# Altium schematic sheet Midi_to_CV.SchDoc
size 381 x 241 mm
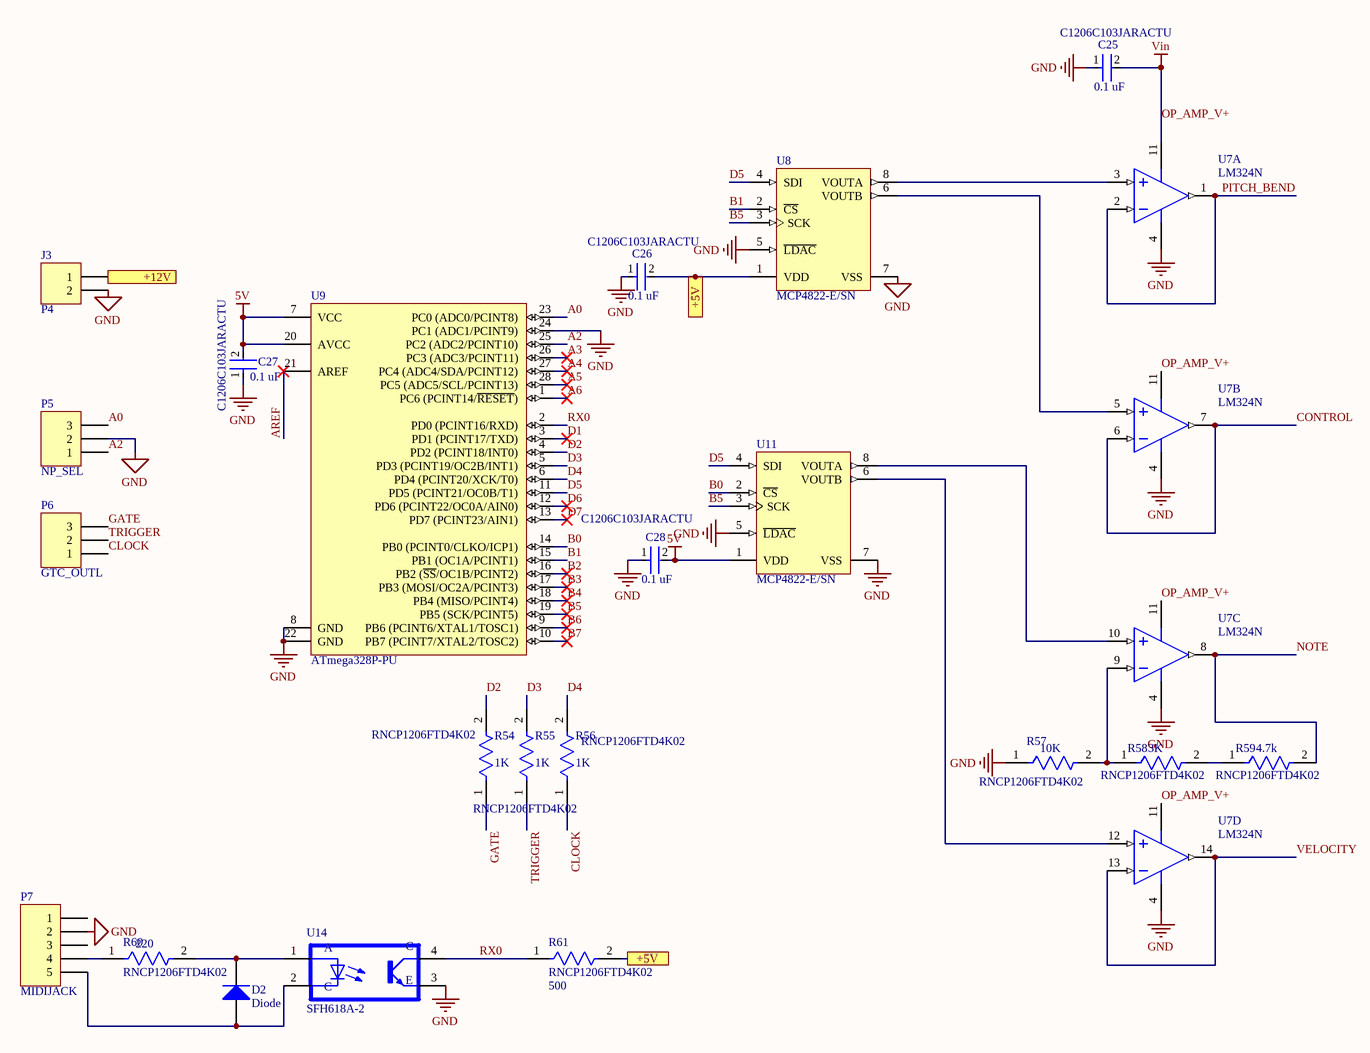
[diagram p0: Midi_to_CV.SchDoc]

## Parts
C25  C1206C103JARACTU  Capacitance: 0.1 uF  [C1206]
C26  C1206C103JARACTU  Capacitance: 0.1 uF  [C1206]
C27  C1206C103JARACTU  Capacitance: 0.1 uF  [C1206]
C28  C1206C103JARACTU  Capacitance: 0.1 uF  [C1206]
D2  Diode  [DIODE-0.4]
P4  J3  [HDR1X2]
P5  NP_SEL  [HDR1X3]
P6  GTC_OUTL  [HDR1X3]
P7  MIDIJACK  [HDR1X5]
R54  RNCP1206FTD4K02  Resistance: 1K  [C1206]
R55  RNCP1206FTD4K02  Resistance: 1K  [C1206]
R56  RNCP1206FTD4K02  Resistance: 1K  [C1206]
R57  RNCP1206FTD4K02  Resistance: 10K  [C1206]
R58  RNCP1206FTD4K02  Resistance: 3K  [C1206]
R59  RNCP1206FTD4K02  Resistance: 4.7k  [C1206]
R60  RNCP1206FTD4K02  Resistance: 220  [C1206]
R61  RNCP1206FTD4K02  Resistance: 500  [C1206]
U7  LM324N  [DIP-14]  (parts A,B,C,D of 4)
U8  MCP4822-E/SN  [SO8_L]
U9  ATmega328P-PU  [DIP787W46P254L3467H508Q28]
U11  MCP4822-E/SN  [SO8_L]
U14  SFH618A-2  [DIP-4]

## Ports
+5V, +12V

## Nets
5V: C27.2 C28.2 U9.7(VCC) U9.20(AVCC) U11.1(VDD)
GND: C25.1 C26.1 C27.1 C28.1 P4.2 P5.2 P7.2 R57.1 U7.4(V+) U8.5(~{LDAC}) U8.7(VSS) U9.8(GND) U9.22(GND) U9.24(PC1_(ADC1/PCINT9)) U11.5(~{LDAC}) U11.7(VSS) U14.3(E)
OP_AMP_V+: C25.2 U7.11(GND)  [also labelled Vin]
+5V: C26.2 R61.2 U8.1(VDD) ; port +5V
+12V: P4.1 ; port +12V
A0: P5.3 U9.23(PC0_(ADC0/PCINT8))
A2: P5.1 U9.25(PC2_(ADC2/PCINT10))
A3: U9.26(PC3_(ADC3/PCINT11))
A4: U9.27(PC4_(ADC4/SDA/PCINT12))
A5: U9.28(PC5_(ADC5/SCL/PCINT13))
A6: U9.1(PC6_(PCINT14/~{RESET}))
AREF: U9.21(AREF)
B0: U9.14(PB0_(PCINT0/CLKO/ICP1)) U11.2(~{CS})
B1: U8.2(~{CS}) U9.15(PB1_(OC1A/PCINT1))
B2: U9.16(PB2_(~{SS}/OC1B/PCINT2))
B3: U9.17(PB3_(MOSI/OC2A/PCINT3))
B4: U9.18(PB4_(MISO/PCINT4))
B5: U8.3(SCK) U9.19(PB5_(SCK/PCINT5)) U11.3(SCK)
B6: U9.9(PB6_(PCINT6/XTAL1/TOSC1))
B7: U9.10(PB7_(PCINT7/XTAL2/TOSC2))
CLOCK: P6.1 R56.1
CONTROL: U7.6(IN2-) U7.7(OUT2)
D1: U9.3(PD1_(PCINT17/TXD))
D2: R54.2 U9.4(PD2_(PCINT18/INT0))
D3: R55.2 U9.5(PD3_(PCINT19/OC2B/INT1))
D4: R56.2 U9.6(PD4_(PCINT20/XCK/T0))
D5: U8.4(SDI) U9.11(PD5_(PCINT21/OC0B/T1)) U11.4(SDI)
D6: U9.12(PD6_(PCINT22/OC0A/AIN0))
D7: U9.13(PD7_(PCINT23/AIN1))
GATE: P6.3 R54.1
NOTE: R59.2 U7.8(OUT3)
PITCH_BEND: U7.1(OUT1) U7.2(IN1-)
RX0: R61.1 U9.2(PD0_(PCINT16/RXD)) U14.4(CO)
TRIGGER: P6.2 R55.1
VELOCITY: U7.13(IN4-) U7.14(OUT4)
NetD2_1: D2.1(A) P7.5 U14.2(C)
NetD2_2: D2.2(K) R60.2 U14.1(A)
NetP7_4: P7.4 R60.1
NetR57_2: R57.2 R58.1 U7.9(IN3-)
NetR58_2: R58.2 R59.1
NetU7_3: U7.3(IN1+) U8.8(VOUTA)
NetU7_5: U7.5(IN2+) U8.6(VOUTB)
NetU7_10: U7.10(IN3+) U11.8(VOUTA)
NetU7_12: U7.12(IN4+) U11.6(VOUTB)

Not connected (* = marked no-connect by the designer): P7 1 3

## Library data of the parts
C25-C28 = b4654b650e69147ec39a6b967a45e02: CAP CER 10000PF 250V 5% X7R 1206; Manufacturer: KEMET; Automotive Grade: Grade 0; Tolerance: 0.05; Material: Ceramic; Value: 10,000 pF; Temperature Coefficient: 15%; Ipc Land Pattern Name: CAPC320160X78; Lead Free: Yes; Device Class L2: Capacitors; ComponentLink2URL: https://content.kemet.com/datasheets/KEM_C1007_X8R_ULTRA_150C_SMD.pdf; Automotive: Yes; Voltage Rating: 250 V; Device Class L1: Passive Components; ComponentLink2Description: Datasheet; Manufacturer Part Number: C1206C103JARACTU; Temperature Range Low: -55°C; RoHS: TRUE; Device Class L3: Ceramic Capacitors; Temperature Range High: +150°C; Temperature: -55°C to +150°C; Height: 0.88mm; Category: Cap; Digikey Description: CAP CER 10000PF 250V 5% X7R 1206; Octopart: https://octopart.com/c1206c103jaractu-kemet-17306149; Package: C1206C-EB; Temperature Characteristic: X7R
D2 = Diode: Default Diode; Published: 8-Jun-2000; LatestRevisionDate: 17-Jul-2002; LatestRevisionNote: Re-released for DXP Platform.; PackageVersion: Sep-1996; PackageReference: SMC; Publisher: Altium Limited; PackageDescription: DO-214-AB/SMC; 2 C-Bend Leads; Body 7.9 x 5.9 mm, inc. leads (LxW); Code_JEDEC: DO-214-AB
P4 = Header 2: Header, 2-Pin; LatestRevisionDate: 17-Jul-2002; LatestRevisionNote: Re-released for DXP Platform.; Publisher: Altium Limited
P5 P6 = Header 3: Header, 3-Pin; LatestRevisionDate: 17-Jul-2002; LatestRevisionNote: Re-released for DXP Platform.; Publisher: Altium Limited
P7 = Header 5: Header, 5-Pin; LatestRevisionDate: 17-Jul-2002; LatestRevisionNote: Re-released for DXP Platform.; Publisher: Altium Limited
R54-R61 = 1029c3af85768c4190bb7ad29bc67b5: 4.02kΩ ±1% 0.5W 1206 High Power Anti-Sulfur Thin Film Chip Resistor; Max Power Dissipation: 500mW; Temperature Coefficient: 100ppm/°C; Width: 0.059inch; Mount: Surface Mount; Length: 0.122inch; Min Operating Temperature: -55°C; Max Operating Temperature: 155°C; RoHS Compliant: Yes; Resistor Type: Thin Film; Case Code (Metric): 3216; Case Code (Imperial): 1206; Lead Free: Lead Free; Height: 0.024inch; Series: RNCP; Number of Terminations: 2; Case/Package: 1206; Tolerance: 1%; Features: Moisture Resistant; Packaging: Cut Tape
U7 = AMP-OPA-LM124-14: Low Power Quad Operational Amplifier, 14-pin MDIP; Manufacturer: Texas Instruments; CompType: Amplifiers; PowerWise: N; PackageTopMarking: NSUZXYYTTE#*LM324N; PackageDescription: MDIP, .750 x .250 x.130in, 14 Lead, .100in Pitch; Package Reference: N0014A; RoHS: N; Code_JEDEC: MS-001-AA; ComponentLink1URL: http://www.ti.com/general/docs/lit/getliterature.tsp?genericPartNumber=LM324&fileType=pdf; ComponentLink1Description: Datasheet URL; PinCount: 14
U8 U11 = CON-DAC-MCP4822-8: 12-Bit DACs with Internal VREF and SPI Interface, 8-Pin SOIC 150mil, Extended Temperature; DatasheetVersion: revA, Apr-2010; ComponentLink3Description: Package Specification; Code_IPC: SOIC127P600-8; ComponentLink2URL: http://ww1.microchip.com/downloads/en/DeviceDoc/22249A.pdf; PackageVersion: revBB, Aug-2009; ComponentLink1Description: Manufacturer URL; PackageDescription: 8-Lead Plastic Small Outline (SN) - Narrow, 3.90mm Body [SOIC]; ComponentLink1URL: http://www.microchip.com/; PackageReference: SOIC-SN8; Code_JEDEC: MS-012; ComponentLink2Description: Datasheet; RevisionNote: URLs added. DatasheetVersion updated. Sch updated.; ComponentLink3URL: http://www.microchip.com/stellent/groups/techpub_sg/documents/packagingspec/en012702.pdf
U9 = MC-8B-ATM48-IL28: 8-bit AVR Microcontroller, 32KB Flash, 1KB EEPROM, 2KB SRAM, 28-pin PDIP, Industrial Grade (-40°C to 85°C); RevisionNote: DatasheetVersion updated. URLs added.; PackageVersion: revB, Sep-2001; PackageDescription: 28-lead (0.300"/7.62mm Wide) Plastic Dual Inline Package (PDIP); DatasheetVersion: revD, May-2011; ComponentLink1Description: Manufacturer URL; ComponentLink1URL: http://www.atmel.com/; PackageReference: 28P3; ComponentLink2Description: ATmega48A/48PA/88A/88PA/168A/168PA/328/328P Datasheet; ComponentLink3URL: http://www.atmel.com/dyn/resources/prod_documents/8271S.pdf; ComponentLink2URL: http://www.atmel.com/dyn/resources/prod_documents/8271.pdf; ComponentLink3Description: ATmega48A/48PA/88A/88PA/168A/168PA/328/328P Summary
U14 = SFH618A-2: Package: None; Price: None; Value: *; MP: SFH618A-2; Availability: Unavailable